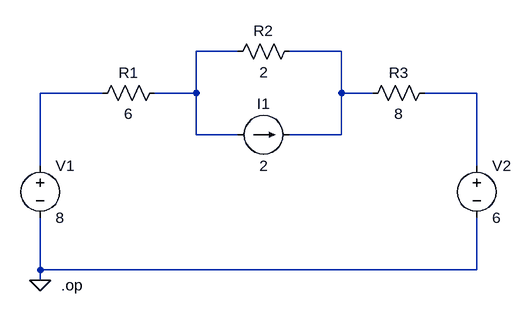
[diagram p0: schematic CH03-KP3-05.asc]
CH03-KP3-05.asc, the LTspice schematic file:
Version 4
SHEET 1 880 680
WIRE 224 160 160 160
WIRE 384 160 304 160
WIRE 16 224 -80 224
WIRE 160 224 160 160
WIRE 160 224 96 224
WIRE 384 224 384 160
WIRE 432 224 384 224
WIRE 592 224 512 224
WIRE 160 288 160 224
WIRE 224 288 160 288
WIRE 384 288 384 224
WIRE 384 288 304 288
WIRE -80 336 -80 224
WIRE 592 336 592 224
WIRE -80 496 -80 416
WIRE 592 496 592 416
WIRE 592 496 -80 496
WIRE -80 512 -80 496
FLAG -80 512 0
SYMBOL res 112 208 R90
WINDOW 0 0 56 VBottom 2
WINDOW 3 32 56 VTop 2
SYMATTR InstName R1
SYMATTR Value 6
SYMBOL res 320 144 R90
WINDOW 0 0 56 VBottom 2
WINDOW 3 32 56 VTop 2
SYMATTR InstName R2
SYMATTR Value 2
SYMBOL res 416 240 R270
WINDOW 0 32 56 VTop 2
WINDOW 3 0 56 VBottom 2
SYMATTR InstName R3
SYMATTR Value 8
SYMBOL voltage -80 320 R0
SYMATTR InstName V1
SYMATTR Value 8
SYMBOL voltage 592 320 R0
SYMATTR InstName V2
SYMATTR Value 6
SYMBOL current 224 288 R270
WINDOW 0 32 40 VTop 2
WINDOW 3 -32 40 VBottom 2
SYMATTR InstName I1
SYMATTR Value 2
TEXT -48 520 Left 2 !.op

The netlist it stands for:
* CH03-KP3-05.asc
R1 N001 N003 6
R2 N002 N001 2
R3 N002 N004 8
V1 N003 0 8
V2 N004 0 6
I1 N001 N002 2
.op
.backanno
.end